# EAGLE design 12v-dual and 5v v1.2 (EAGLE 9.6.2)
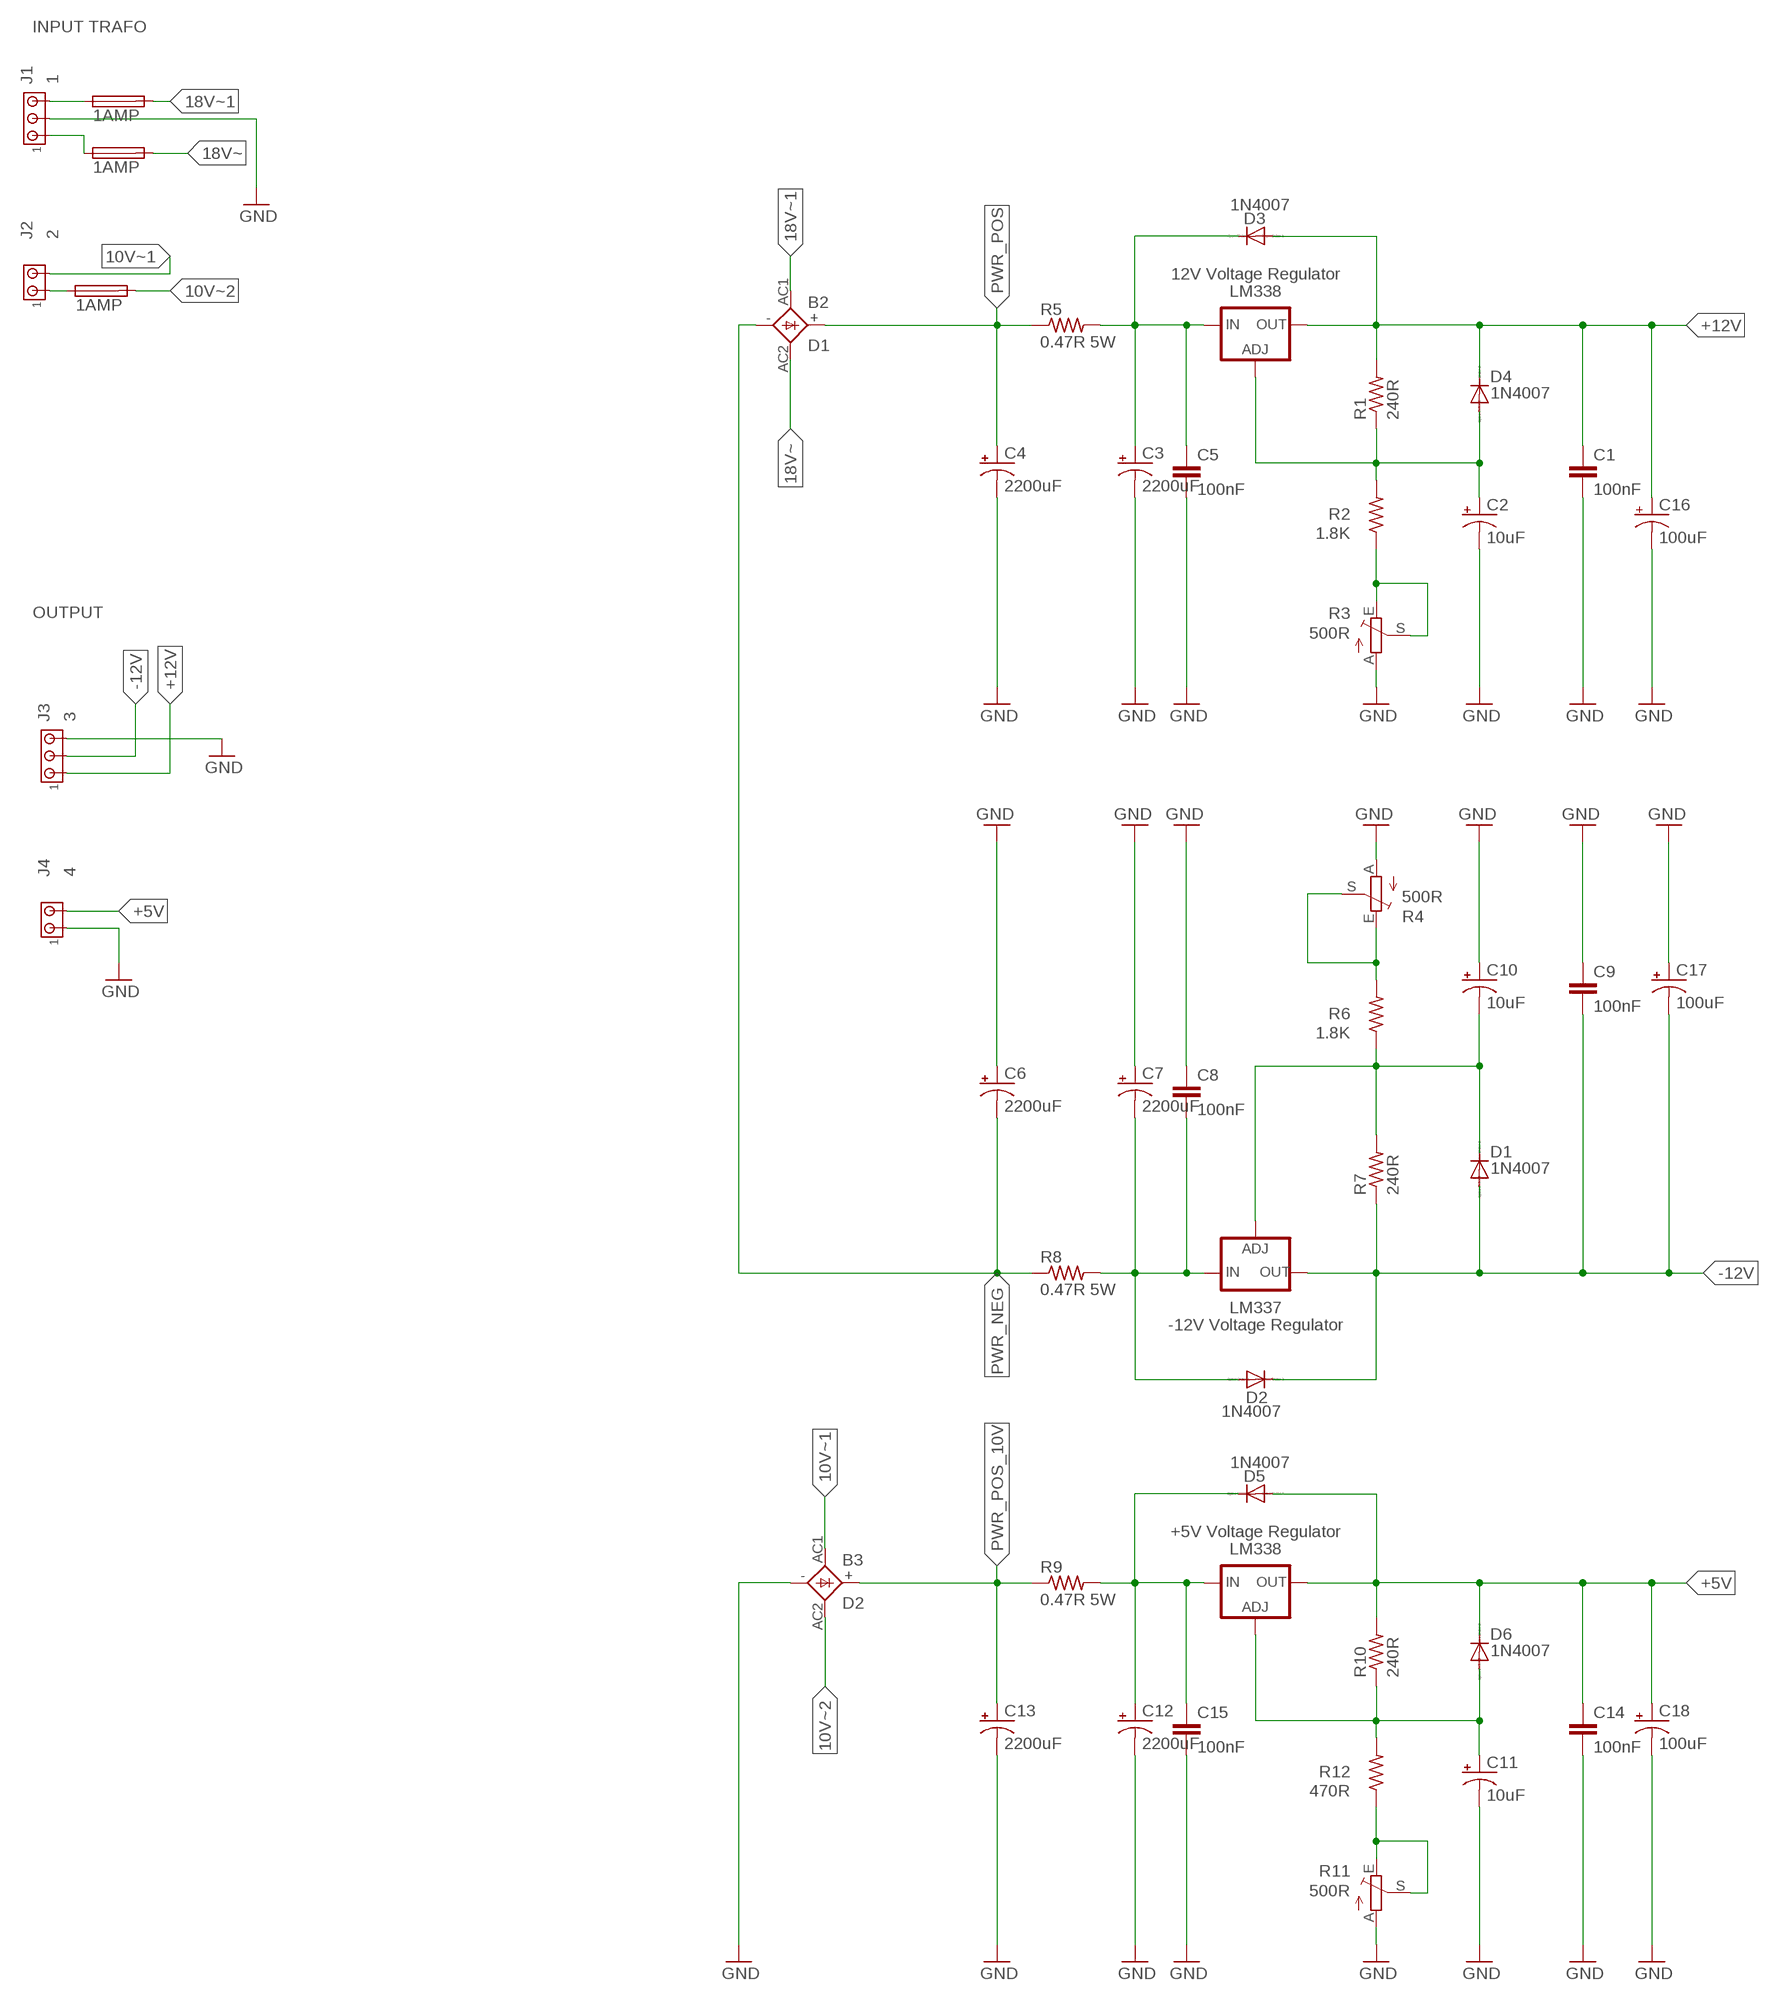
[diagram p0: schematic, sheet 1]

## Parts
B2  D1  FB15  [FB15]
B3  D2  FB15  [FB15]
C1  100nF  C-EU050-025X075  [C050-025X075]
C2  10uF  CPOL-USE2-5  [E2-5]
C3  2200uF  CPOL-USE5-13  [E5-13]
C4  2200uF  CPOL-USE5-13  [E5-13]
C5  100nF  C-EU050-025X075  [C050-025X075]
C6  2200uF  CPOL-USE5-13  [E5-13]
C7  2200uF  CPOL-USE5-13  [E5-13]
C8  100nF  C-EU050-025X075  [C050-025X075]
C9  100nF  C-EU050-025X075  [C050-025X075]
C10  10uF  CPOL-USE2-5  [E2-5]
C11  10uF  CPOL-USE2-5  [E2-5]
C12  2200uF  CPOL-USE5-13  [E5-13]
C13  2200uF  CPOL-USE5-13  [E5-13]
C14  100nF  C-EU050-025X075  [C050-025X075]
C15  100nF  C-EU050-025X075  [C050-025X075]
C16  100uF  CPOL-USE2-5  [E2-5]
C17  100uF  CPOL-USE2-5  [E2-5]
C18  100uF  CPOL-USE2-5  [E2-5]
D1  1N4007  1N4004  [DO41-10]
D2  1N4007  1N4004  [DO41-10]
D3  1N4007  1N4004  [DO41-10]
D4  1N4007  1N4004  [DO41-10]
D5  1N4007  1N4004  [DO41-10]
D6  1N4007  1N4004  [DO41-10]
F1  1AMP  SH25  [SH25]
F2  1AMP  SH25  [SH25]
F3  1AMP  SH25  [SH25]
IC1  LM337  LM337TS  [337TS]
IC2  LM338  LM317TS  [317TS]
IC3  LM317MB  LM317TS  [317TS]
J1  1  MTA03-156  [1X3MTA]
J2  2  MTA02-156  [1X2MTA]
J3  3  MTA03-156  [1X3MTA]
J4  4  MTA02-156  [1X2MTA]
R1  240R  R-US_0204/7  [0204/7]
R2  1.8K  R-US_0204/7  [0204/7]
R3  500R  TRIM_EU-RJ9W  [RJ9W]
R4  500R  TRIM_EU-RJ9W  [RJ9W]
R5  0.47R 5W  R-US_0617/17  [0617/17]
R6  1.8K  R-US_0204/7  [0204/7]
R7  240R  R-US_0204/7  [0204/7]
R8  0.47R 5W  R-US_0617/17  [0617/17]
R9  0.47R 5W  R-US_0617/17  [0617/17]
R10  240R  R-US_0204/7  [0204/7]
R11  500R  TRIM_EU-RJ9W  [RJ9W]
R12  470R  R-US_0204/7  [0204/7]

## Nets
10V~1: B3.AC1 J2.2
10V~2: B3.AC2 F3.2
18V~: B2.AC2 F2.2
18V~1: B2.AC1 F1.2
18V~2: F2.1 J1.1
+5V: C14.1 C18.+ D5.A D6.C IC3.2(OUT) J4.2 R10.2
+12V: C1.1 C16.+ D3.A D4.C IC2.2(OUT) J3.1 R1.2
-12V: C9.2 C17.- D1.A D2.C IC1.3(OUT) J3.2 R7.1
ADJ-NEG: C10.- D1.C IC1.1(ADJ) R6.1 R7.2
ADJ-POS: C2.+ D4.A IC2.1(ADJ) R1.1 R2.2
ADJ-POS1: C11.+ D6.A IC3.1(ADJ) R10.1 R12.2
GND: B3.- C1.2 C2.- C3.- C4.- C5.2 C6.+ C7.+ C8.1 C9.1 C10.+ C11.- C12.- C13.- C14.2 C15.2 C16.- C17.+ C18.- J1.2 J3.3 J4.1 R3.A R4.A R11.A
N$1: R2.1 R3.E R3.S
N$2: R11.E R11.S R12.1
N$3: F1.1 J1.3
N$4: F3.1 J2.1
N$5: R4.E R4.S R6.2
NEG-IN: C7.- C8.2 D2.A IC1.2(IN) R8.2
PWR_NEG: B2.- C6.- R8.1
PWR_POS: B2.+ C4.+ R5.1
PWR_POS_10V: B3.+ C13.+ R9.1
VIN: C3.+ C5.1 D3.C IC2.3(IN) R5.2
VIN1: C12.+ C15.1 D5.C IC3.3(IN) R9.2

## Notes on the sheet
- INPUT TRAFO
- 12V Voltage Regulator
- LM338
- OUTPUT
- LM337
- -12V Voltage Regulator
- +5V Voltage Regulator
- LM338

## Library data of the parts
B2 B3 = rectifier:FB15: FAGOR RECTIFIER grid 3 x 5 mm
C1 C5 C8 C9 C14 C15 = rcl:C-EU: CAPACITOR, European symbol; SPICEPREFIX: C
C2-C4 C6 C7 C10-C13 C16-C18 = adafruit:CPOL-US: POLARIZED CAPACITOR, American symbol
D1-D6 = diode:1N4004: DIODE general purpose rectifier, 1 A
F1-F3 = fuse:SH25: FUSE HOLDER grid 25 mm, OGN0031 8211, Schurter (Buerklin); MF: SCHURTER; MPN: 0031.8211; OC_FARNELL: 1162741; OC_NEWARK: 96B9380
IC1 = v-reg:LM337TS: VOLTAGE REGULATOR
IC2 IC3 = v-reg:LM317TS: VOLTAGE REGULATOR; PARTNUMBER: LM317M
J1 J3 = con-amp:MTA03-156: AMP connector
J2 J4 = con-amp:MTA02-156: AMP connector
R1 R2 R5-R10 R12 = BeagleBone_Black_Wireless:R-US_: RESISTOR, American symbol
R3 R4 R11 = pot:TRIM_EU-: POTENTIOMETER

## Board
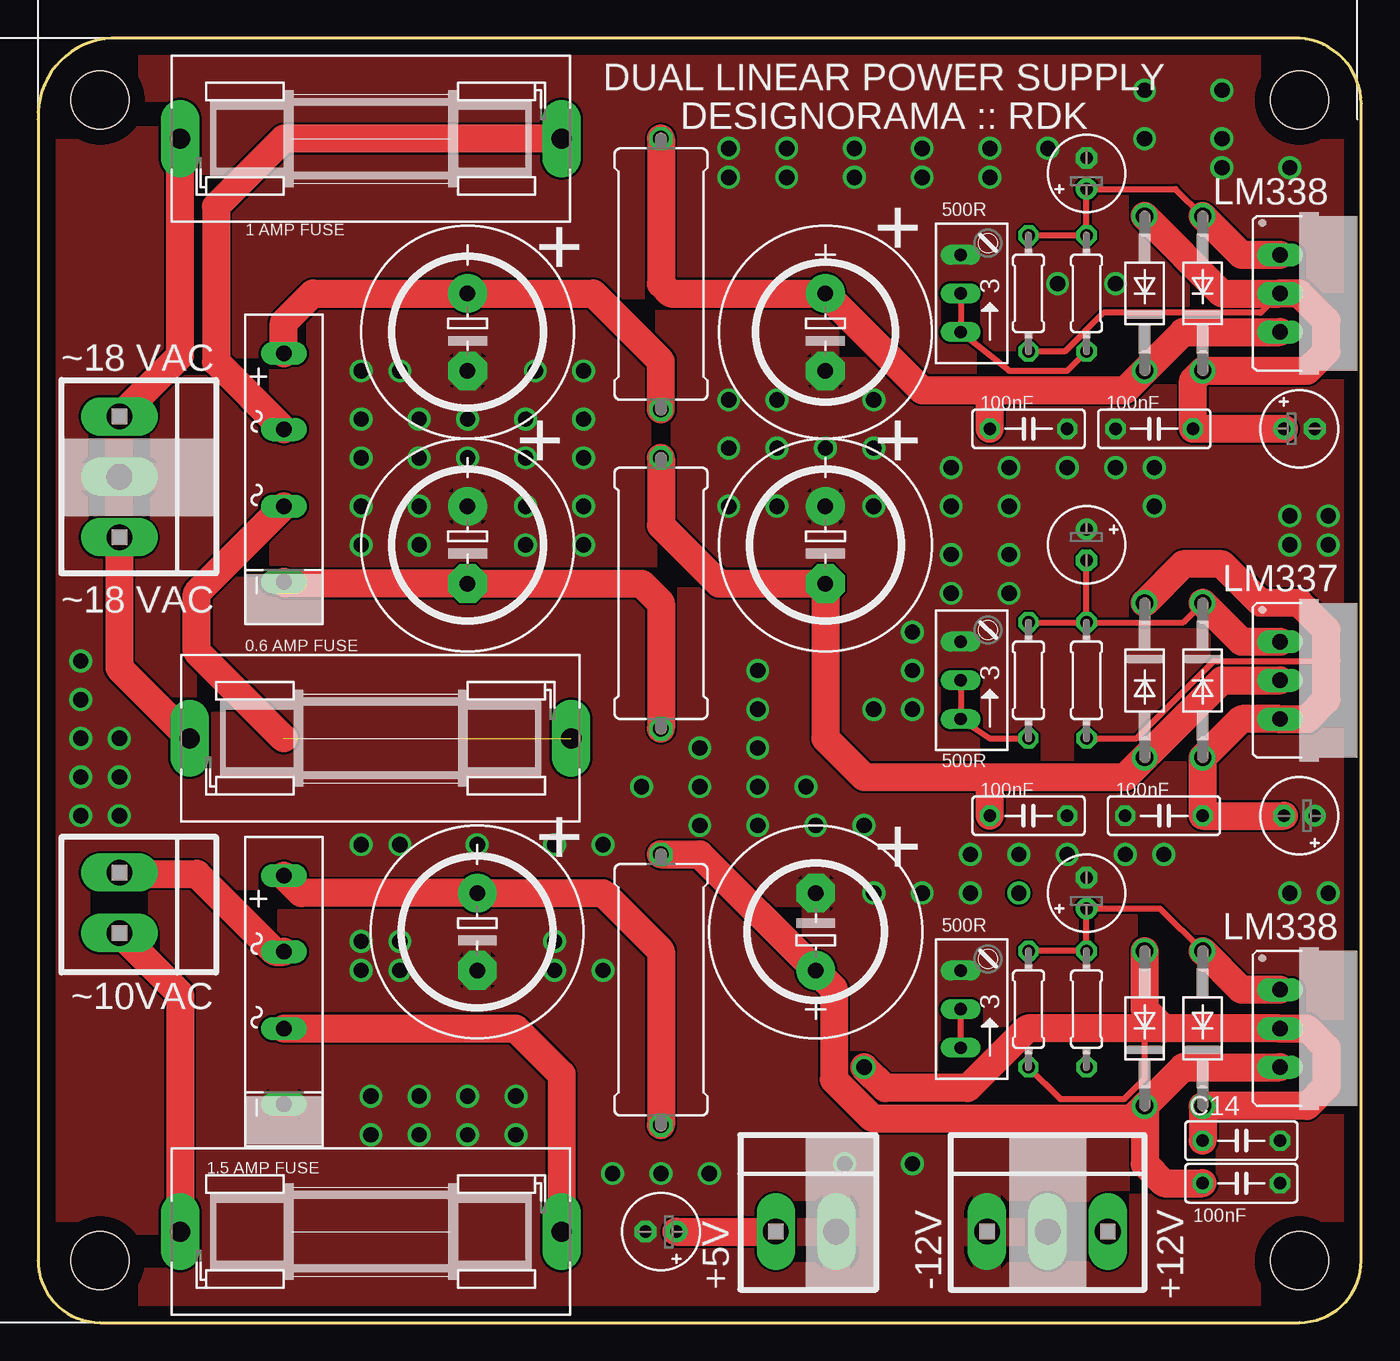
[diagram p1: board, top side]
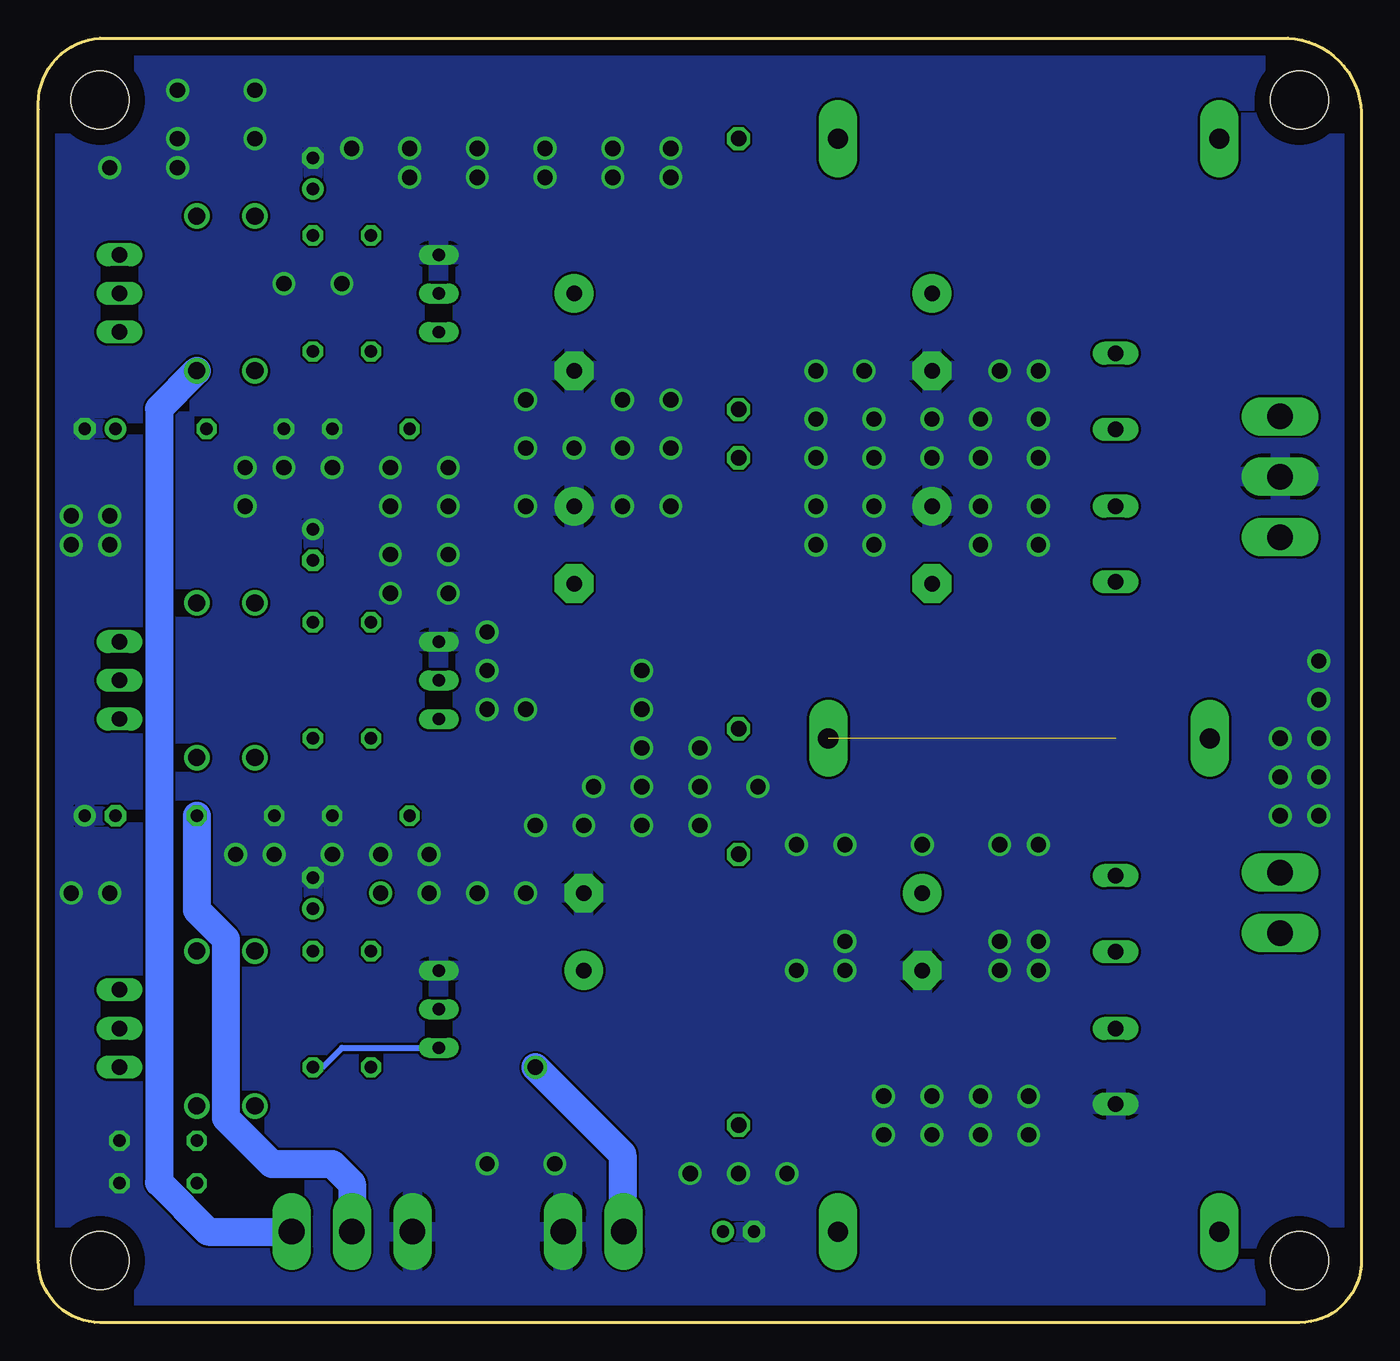
[diagram p2: board, bottom side, seen from below]

Size 86.88 x 84.33 mm. Coordinates in mm from the lower left corner, seen from the top.
Outline: 4.83,84.33 arc90 0,78.99 0,4.06 arc90 4.07,0 82.81,0 arc90 86.87,4.06 86.87,79.63 arc90 82.81,84.33 4.83,84.33
Copper layers (1*16): Top 0.035mm / dielectric 1.5mm / Bottom 0.035mm
Design rules "default": minimum track width 6mil, minimum drill 0.35mm, track to track 6mil, track to pad 6mil, pad to pad 6mil, via to via 6mil, smd to smd 6mil, copper to edge 40mil, drill to drill 6mil, minimum pad ring 10mil, minimum via ring 8mil, stop-mask expansion 4mil, vias tented up to drill 0mil, thermal gap 10mil
Holes 3.81 mm at 4.07,80.26 82.81,80.26 82.81,4.06 4.07,4.06

### Footprints (pad centres in the part's own frame; a part is rotated, then mirrored left to right if it is on the bottom)
FB15 = drill 1.016 long: + -7.5,0; - 7.511,0; AC1 -2.496,0; AC2 2.533,0
C050-025X075 = drill 0.813 octagon: 1 -2.54,0; 2 2.54,0
E2-5 = drill 0.813 pad 1.422: + -1.016,0 | drill 0.813 pad 1.422 octagon: - 1.016,0
E5-13 = drill 1.016 pad 2.54: + -2.54,0 | drill 1.016 pad 2.54 octagon: - 2.54,0
DO41-10 = drill 1.118: A 5.08,0; C -5.08,0
SH25 = drill 1.321 pad 2.54 long: 1 -12.522,0; 2 12.522,0
337TS = drill 1.016 long: 1 -2.54,-2.54; 2 0,-2.54; 3 2.54,-2.54
317TS = drill 1.016 long: 1 -2.54,-2.54; 2 0,-2.54; 3 2.54,-2.54
1X3MTA = drill 1.676 long: 1 3.937,0; 2 -0.025,0; 3 -3.988,0
1X2MTA = drill 1.676 long: 1 1.981,0; 2 -1.981,0
0204/7 = drill 0.813 octagon: 1 -3.81,0; 2 3.81,0
RJ9W = drill 0.813 long: A 2.54,0.635; E -2.54,0.635; S 0,0.635
0617/17 = drill 1.016 octagon: 1 -8.89,0; 2 8.89,0

### Placement (x,y rotation side)
B2  16.13,56.13 270 top
B3  16.13,21.84 270 top
C1  73.28,58.67 180 top
C2  68.84,75.44 90 top
C3  51.69,65.02 270 top
C4  28.2,65.02 270 top
C5  65.03,58.67 0 top
C6  28.2,51.05 270 top
C7  51.69,51.05 270 top
C8  65.03,33.27 180 top
C9  73.92,33.27 0 top
C10  68.84,51.05 270 top
C11  68.84,28.19 90 top
C12  51.06,25.65 90 top
C13  28.83,25.65 270 top
C14  79,11.94 0 top
C15  79,9.14 0 top
C16  82.81,58.67 0 top
C17  82.81,33.27 180 top
C18  40.9,5.97 180 top
D1  76.46,42.16 270 top
D2  72.65,42.16 270 top
D3  72.65,67.56 90 top
D4  76.46,67.56 90 top
D5  72.65,19.3 90 top
D6  76.46,19.3 90 top
F1  21.85,77.72 0 top
F2  22.48,38.35 0 top
F3  21.85,5.97 0 top
IC1  84.08,42.16 270 top
IC2  84.08,67.56 270 top
IC3  84.08,19.3 270 top
J1  5.34,55.5 270 top
J2  5.34,27.56 270 top
J3  66.3,5.97 0 top
J4  50.42,5.97 0 top
R1  65.03,67.56 270 top
R2  68.84,67.56 90 top
R3  61.22,67.56 90 top
R4  61.22,42.16 90 top
R5  40.9,68.83 90 top
R6  65.03,42.16 270 top
R7  68.84,42.16 90 top
R8  40.9,47.88 90 top
R9  40.9,21.84 90 top
R10  65.03,20.57 270 top
R11  61.22,20.57 90 top
R12  68.84,20.57 90 top

### Tracks (layer width: path | path; a pad name or v marks a point on that pad's centre or on a via)
10V~1
  Top 1.829: J2.2 5.41,29.46 10.42,29.46 15.54,24.34 B3.AC1
10V~2
  Top 1.829: B3.AC2 31.36,19.31 34.37,16.31 F3.2
18V~  (1 unrouted)
  Top 1.829: 16.13,38.35 10.42,44.07 10.42,47.89 B2.AC2
18V~1
  Top 1.829: F1.2 16.13,77.72 11.69,73.28 11.69,63.07 B2.AC1
18V~2
  Top 1.829: J1.1 5.34,42.98 F2.1
+5V  (via drill 1)
  Top 0.406: R10.2 67.11,14.68 71.31,14.68 72.65,16.02 72.65,19.3
  Top 1.829: 73.92,19.3 IC3.2 83.31,19.3 84.58,18.03 84.58,15.49 83.31,14.22 D6.C C14.1 | 73.92,19.3 72.65,20.57 D5.A | 73.92,19.3 72.65,19.3 64.95,19.3 61.04,15.39 55.6,15.39 v54.23,16.76 | C18.+ J4.2
  Bottom 1.829: J4.2 48.52,6.04 48.52,11.05 v54.23,16.76
+12V
  Top 0.406: IC2.2 80.27,66.29 69.94,66.29 67.4,63.75 R1.2
  Top 1.829: D3.A 77.73,67.56 IC2.2 82.81,67.56 84.58,65.79 84.58,63.75 83.31,62.48 D4.C 75.82,61.85 C1.1 C16.+
  Bottom 1.829: D4.C 78.94,59.99 78.94,9.19 75.72,5.97 J3.1
-12V
  Top 0.406: R7.1 72.12,38.35 77.2,43.43 84.58,43.43
  Top 1.829: D2.C 75.19,49.78 77.73,49.78 80.27,47.24 82.81,47.24 84.58,45.47 84.58,43.43 84.58,40.89 83.31,39.62 IC1.3 79,39.62 D1.A C9.2 C17.-
  Bottom 1.829: C9.2 76.46,27.08 74.55,25.17 74.55,13.43 71.53,10.41 67.57,10.41 66.27,9.12 J3.2
ADJ-NEG
  Top 0.406: R7.2 C10.- | R6.1 R7.2 | R7.2 75.19,45.97 D1.C
  Top 1.829: D1.C 79,44.7 IC1.1
ADJ-POS
  Top 0.406: R1.1 R2.2 C2.+ 74.68,74.42 D4.A
  Top 1.829: D4.A 79,70.1 IC2.1
ADJ-POS1
  Top 0.406: R10.1 R12.2 C11.+ 73.66,27.18 D6.A
  Top 1.829: IC3.1 79,21.84 D6.A
GND  (via drill 1)
  other vias: 49.15,77.09 49.15,75.18 53.6,77.09 53.6,75.18 58.04,77.09 58.04,75.18 62.49,77.09 62.49,75.18 48.52,60.58 51.69,57.4 82.17,51.05 82.17,52.96 82.17,28.19 25.02,53.59 32.01,53.59 28.2,56.77 39.63,35.18 43.44,35.18 47.25,35.18 47.25,37.72 50.42,35.18 43.44,37.72 37.72,9.78 40.9,9.78 59.95,53.59 63.76,53.59 63.76,50.42 59.95,50.42 21.85,14.86 25.02,14.86 28.2,14.86 31.37,14.86 21.85,12.32 25.02,12.32 28.2,12.32 31.37,12.32 44.07,9.78 47.25,32.64 43.44,32.64 72.65,77.72 77.73,77.72 77.73,80.9 72.65,80.9 73.28,53.59 73.28,56.13 70.74,56.13 67.57,56.13 63.76,56.13 59.95,56.13 54.87,53.59 48.52,53.59 48.52,57.4 54.87,57.4 54.87,60.58 51.06,32.64 54.23,32.64 54.87,28.19 58.04,28.19 61.22,28.19 61.22,30.73 64.39,30.73 71.38,30.73 67.57,30.73 57.41,10.41 52.96,10.41 23.75,31.37 28.83,31.37 23.75,25.02 33.91,25.02 33.91,31.37 25.02,51.05 25.02,56.77 32.01,56.77 32.01,51.05 21.21,56.77 35.82,56.77 35.82,62.48 32.64,62.48 23.75,62.48 35.82,59.31 32.01,59.31 25.02,59.31 28.2,59.31 21.21,59.31 21.21,62.48 5.34,33.27 5.34,35.81 5.34,38.35 2.8,33.27 2.8,35.81 2.8,38.35 2.8,40.89 2.8,43.43 73.92,30.73 84.71,28.19 84.71,52.96 84.71,51.05 66.93,68.2 70.74,68.2 77.73,75.82 82.17,75.82 66.3,77.09 45.34,77.09 45.34,75.18 21.21,53.59 21.21,51.05 35.82,53.59 35.82,51.05 45.34,57.4 45.34,60.58 45.34,53.59 21.21,31.37 37.09,31.37 37.09,23.11 33.91,23.11 23.75,23.11 21.21,23.11 21.21,25.02 47.25,40.26 47.25,42.8 54.87,40.26 57.41,40.26 57.41,42.8 57.41,45.34 59.95,47.88 63.76,47.88
  pour Bottom: -8.63,88.52 -8.63,-7.37 96.78,-7.37 96.78,88.52
  pour Top: -7.36,87.88 -7.36,-2.92 102.49,-2.92 102.49,87.88
N$1
  Top 0.406: R3.S R3.E 63.76,62.48 67.57,62.48 R2.1
N$2
  Top 0.406: R11.E R11.S
  Bottom 0.406: R12.1 68.2,16.76 66.93,18.03 R11.E
N$3
  Top 1.829: F1.1 9.32,63.47 J1.3
N$4
  Top 1.829: J2.1 9.32,21.59 F3.1
N$5
  Top 0.406: R4.S R4.E 62.49,38.35 R6.2
N$14  (via drill 1)
  other vias: 64.39,28.19
NEG-IN
  Top 1.829: 62.49,35.81 71.38,35.81 D2.A 77.73,42.16 IC1.2 | C8.2 62.49,35.81 | R8.2 40.9,52.32 44.71,48.51 C7.- 51.69,38.35 54.23,35.81 62.49,35.81
PWR_NEG
  Top 1.829: B2.- 16.24,48.51 C6.- 39.63,48.51 40.9,47.24 R8.1
PWR_POS
  Top 1.829: B2.+ 16.13,65.66 18.04,67.56 C4.+ 36.45,67.56 40.9,63.12 R5.1
PWR_POS_10V
  Top 1.829: B3.+ 17.28,28.19 C13.+ 37.09,28.19 40.9,24.38 R9.1
VIN
  Top 1.829: 62.49,61.21 71.38,61.21 D3.C 75.19,65.02 IC2.3 | C5.1 62.49,61.21 | 62.49,61.21 58.04,61.21 C3.+ 41.53,67.56 40.9,68.2 R5.2
VIN1
  Top 1.829: D5.C 75.19,16.76 IC3.3 | D5.C 72.65,10.41 73.92,9.14 C15.1 | D5.C 71.83,13.41 54.78,13.41 52.25,15.94 52.25,21.92 C12.+ 43.44,30.73 R9.2

### Text on the board
tPlace: ~18 VAC | ~18 VAC | ~10VAC | +5V | -12V | +12V
tNames: DUAL LINEAR POWER SUPPLY | DESIGNORAMA :: RDK | LM338 | 500R | 1 AMP FUSE | + | + | 100nF | 100nF | + | + | LM337 | 0.6 AMP FUSE | 500R | 100nF | 100nF | + | + | LM338 | 500R | 1.5 AMP FUSE | 100nF